# EAGLE design IN-12 (EAGLE 9.6.2)
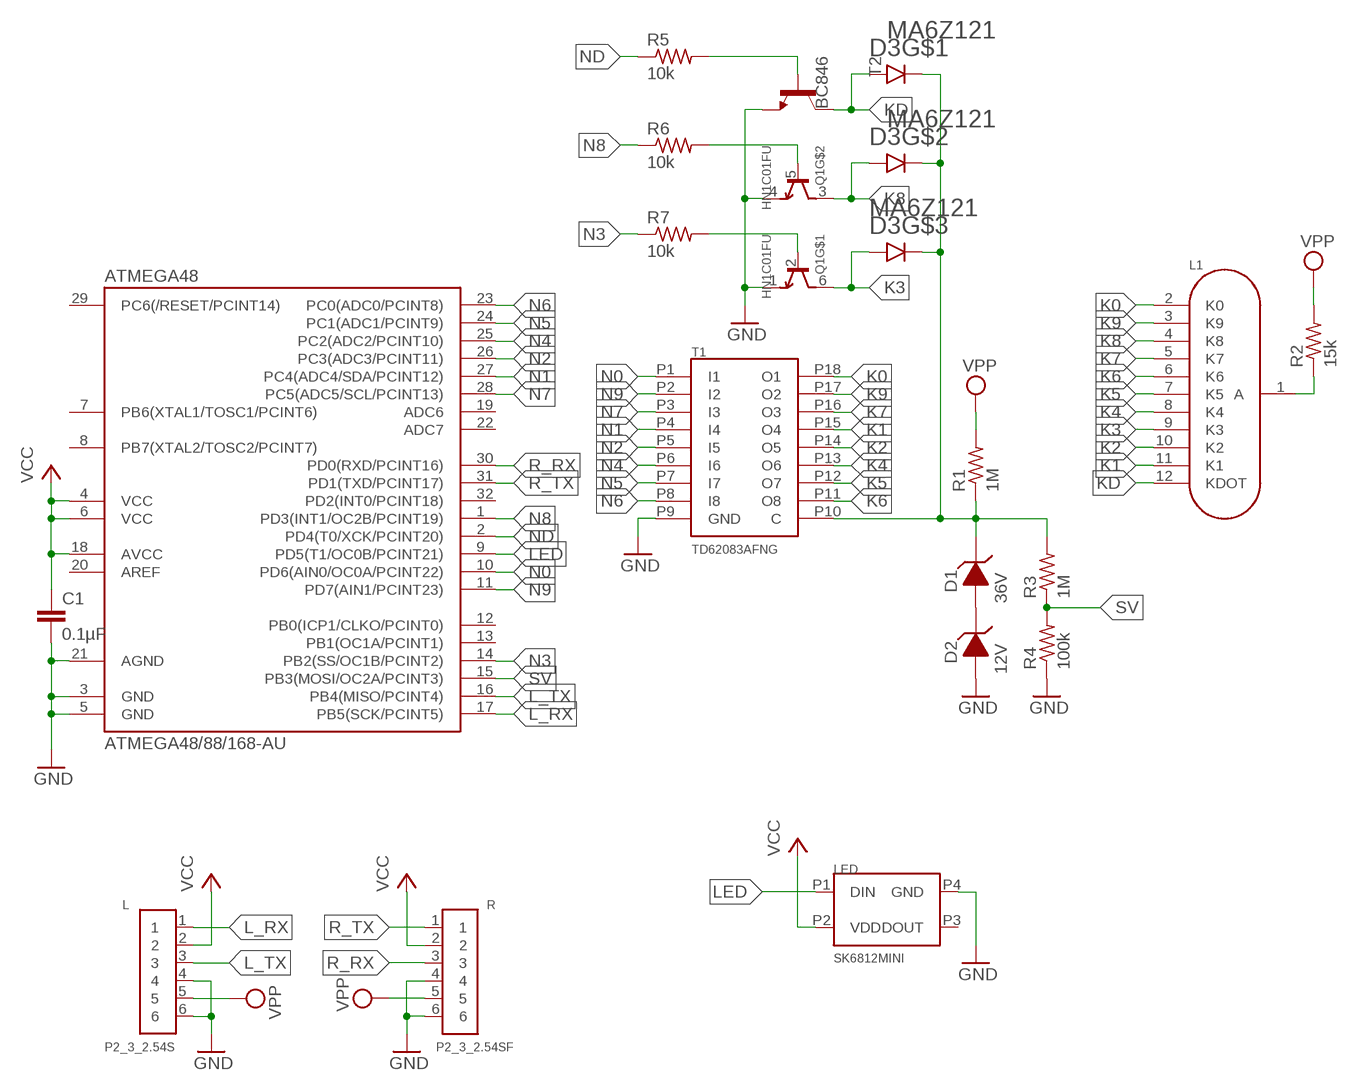
[diagram p0: schematic, sheet 1]

## Parts
ATMEGA48  ATMEGA48/88/168-AU  [TQFP32-08]
C1  0.1µF  C-EUC0603  [C0603]
D1  36V  D_ZENERG  [S-MINI-2P]
D2  12V  D_ZENERG  [S-MINI-2P]
D3  MA6Z121  [SMINI6-F1]
L  P2_3_2.54S  [P2_3_2.54S]
L1  IN-12B_PS  [IN-12_PS]
LED  SK6812MINI  [SK68XXMINI]
Q1  HN1C01FU  [SOT-363]
R  P2_3_2.54SF  [P2_3_2.54SF]
R1  1M  R-US_R0603  [R0603]
R2  15k  R-US_R1206  [R1206]
R3  1M  R-US_R0603  [R0603]
R4  100k  R-US_R0603  [R0603]
R5  10k  R-US_R0603  [R0603]
R6  10k  R-US_R0603  [R0603]
R7  10k  R-US_R0603  [R0603]
T1  TD62083AFNG  [SSOP18-P-225-0.65]
T2  BC846  [SOT23]

## Nets
GND: ATMEGA48.3(GND) ATMEGA48.5(GND) ATMEGA48.21(AGND) C1.2 D2.1(A) L.4 L.6 LED.P4(GND) Q1.1(E) Q1.4(E) R4.1 R.4 R.6 T1.P9(GND) T2.2(E)
K0: L1.2(K0) T1.P18(O1)
K1: L1.11(K1) T1.P15(O4)
K2: L1.10(K2) T1.P14(O5)
K3: D3.P3(A) L1.9(K3) Q1.6(C)
K4: L1.8(K4) T1.P13(O6)
K5: L1.7(K5) T1.P12(O7)
K6: L1.6(K6) T1.P11(O8)
K7: L1.5(K7) T1.P16(O3)
K8: D3.P2(A) L1.4(K8) Q1.3(C)
K9: L1.3(K9) T1.P17(O2)
KD: D3.P1(A) L1.12(KDOT) T2.3(C)
L_RX: ATMEGA48.17(PB5(SCK/PCINT5)) L.1
L_TX: ATMEGA48.16(PB4(MISO/PCINT4)) L.3
LED: ATMEGA48.9(PD5(T1/OC0B/PCINT21)) LED.P1(DIN)
N0: ATMEGA48.10(PD6(AIN0/OC0A/PCINT22)) T1.P1(I1)
N1: ATMEGA48.27(PC4(ADC4/SDA/PCINT12)) T1.P4(I4)
N2: ATMEGA48.26(PC3(ADC3/PCINT11)) T1.P5(I5)
N3: ATMEGA48.14(PB2(SS/OC1B/PCINT2)) R7.1
N4: ATMEGA48.25(PC2(ADC2/PCINT10)) T1.P6(I6)
N5: ATMEGA48.24(PC1(ADC1/PCINT9)) T1.P7(I7)
N6: ATMEGA48.23(PC0(ADC0/PCINT8)) T1.P8(I8)
N7: ATMEGA48.28(PC5(ADC5/SCL/PCINT13)) T1.P3(I3)
N8: ATMEGA48.1(PD3(INT1/OC2B/PCINT19)) R6.1
N9: ATMEGA48.11(PD7(AIN1/PCINT23)) T1.P2(I2)
N$1: D1.1(A) D2.2(C)
N$2: D1.2(C) D3.P4(C) D3.P5(C) D3.P6(C) R1.1 R3.2 T1.P10(C)
N$11: L1.1(A) R2.1
N$12: Q1.2(B) R7.2
N$14: Q1.5(B) R6.2
N$15: R5.2 T2.1(B)
ND: ATMEGA48.2(PD4(T0/XCK/PCINT20)) R5.1
R_RX: ATMEGA48.30(PD0(RXD/PCINT16)) R.3
R_TX: ATMEGA48.31(PD1(TXD/PCINT17)) R.1
SV: ATMEGA48.15(PB3(MOSI/OC2A/PCINT3)) R3.1 R4.2
VCC: ATMEGA48.4(VCC) ATMEGA48.6(VCC) ATMEGA48.18(AVCC) C1.1 L.2 LED.P2(VDD) R.2
VPP: L.5 R1.2 R2.2 R.5
Unconnected: ATMEGA48.7(PB6(XTAL1/TOSC1/PCINT6)) ATMEGA48.8(PB7(XTAL2/TOSC2/PCINT7)) ATMEGA48.12(PB0(ICP1/CLKO/PCINT0)) ATMEGA48.13(PB1(OC1A/PCINT1)) ATMEGA48.19(ADC6) ATMEGA48.20(AREF) ATMEGA48.22(ADC7) ATMEGA48.29(PC6(/RESET/PCINT14)) ATMEGA48.32(PD2(INT0/PCINT18)) LED.P3(DOUT)

## Library data of the parts
ATMEGA48 = atmega8:ATMEGA48/88/168
C1 = rcl:C-EU: CAPACITOR, European symbol; SPICEPREFIX: C
D1 D2 = m-pad-2.1:D_ZENER: Zener diodes in various packages
D3 = diodes:MA6Z121
L = pins:P2_3_2.54S
L1 = nixie-tube:IN-12B_PS
LED = leds:SK6812MINI
Q1 = transistors:HN1C01FU
R = pins:P2_3_2.54SF
R1-R7 = rcl:R-US_: RESISTOR, American symbol; SPICEPREFIX: R
T1 = transistors:TD62083AFNG
T2 = transistor:BC846: NPN TRANSISTOR

## Board
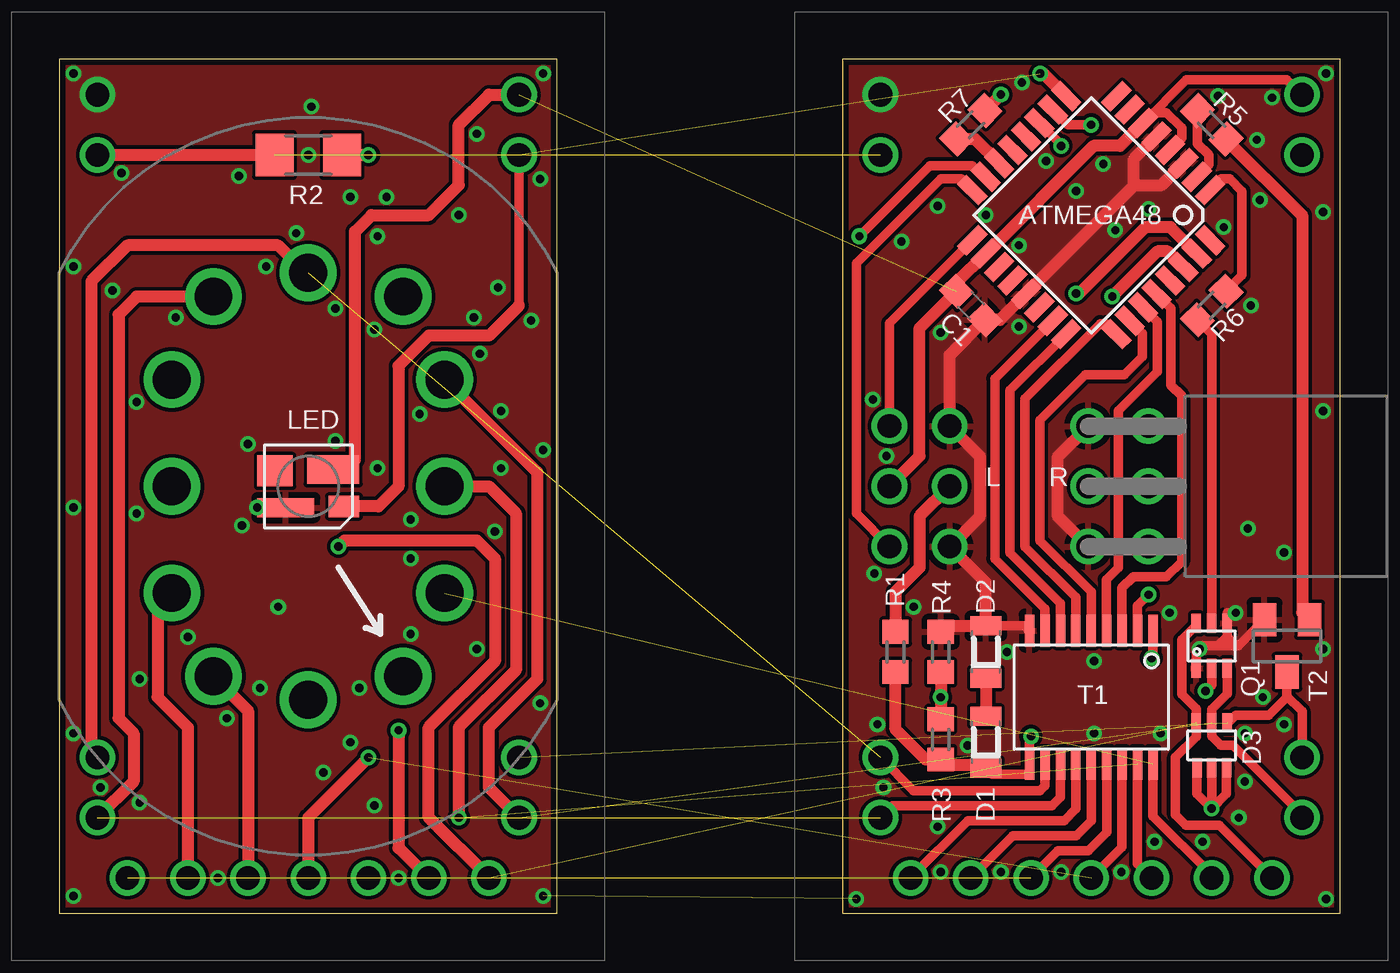
[diagram p1: board, top side]
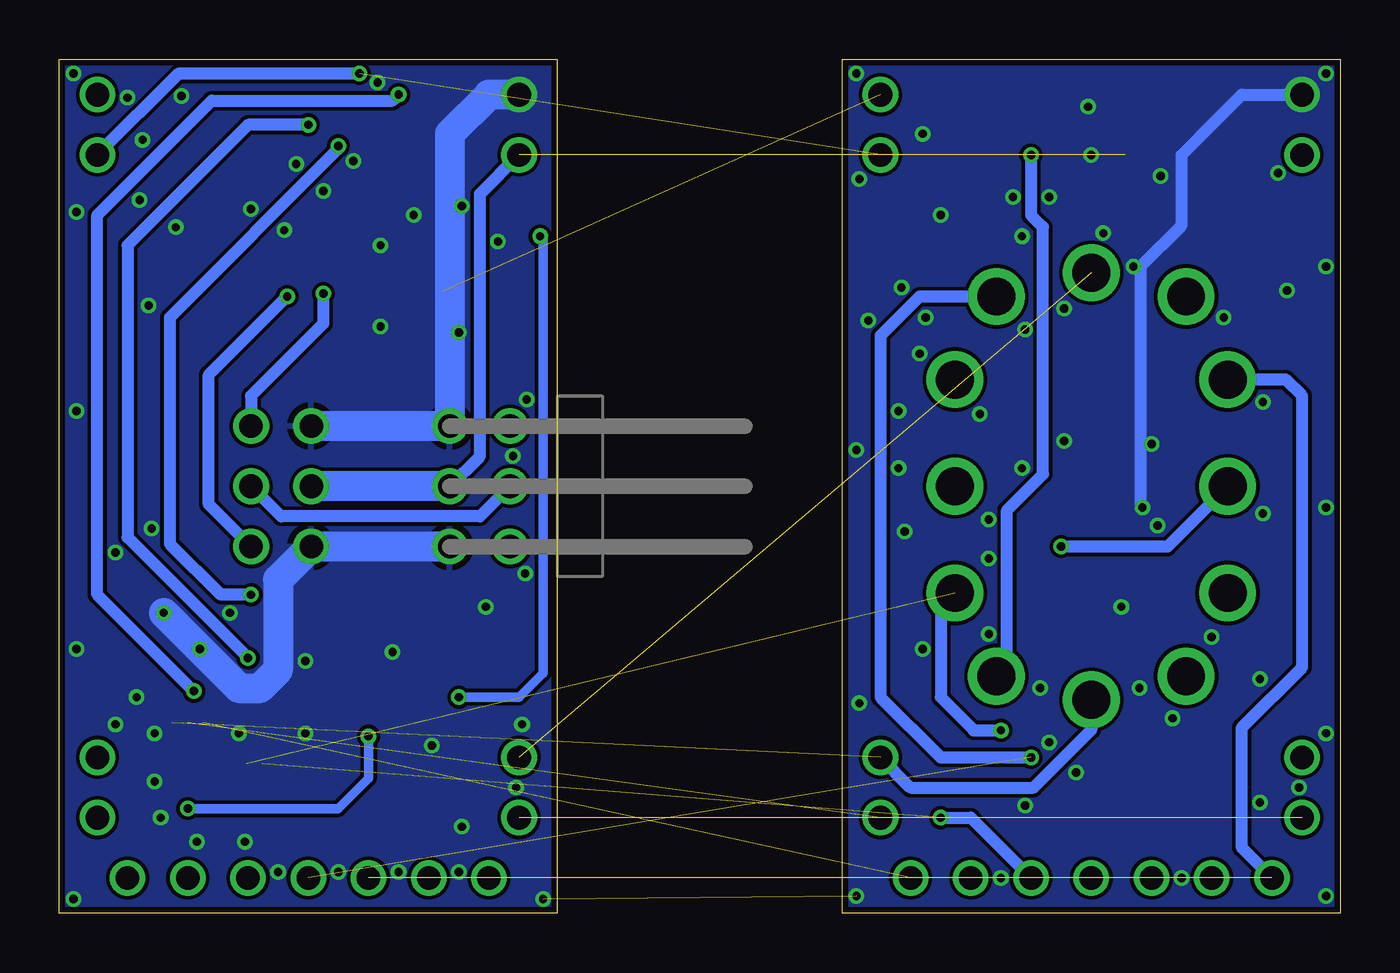
[diagram p2: board, bottom side, seen from below]

Size 54.02 x 36 mm. Coordinates in mm from the lower left corner, seen from the top.
Outline: 0,0 21,0 21,36 0,36 0,0
Outline: 33.02,0 54.02,0 54.02,36 33.02,36 33.02,0
Copper layers (1*16): Top 0.035mm / dielectric 1.5mm / Bottom 0.035mm
Design rules "SeeedStudio_2layer_DRU_no_angle_20140221": minimum track width 6mil, minimum drill 12mil, track to track 6mil, track to pad 6mil, pad to pad 6mil, via to via 6mil, smd to smd 0mil, copper to edge 10mil, drill to drill 10mil, minimum pad ring 10mil, minimum via ring 6mil, stop-mask expansion 2mil, vias tented up to drill 100mil, thermal gap 10mil

### Footprints (pad centres in the part's own frame; a part is rotated, then mirrored left to right if it is on the bottom)
TQFP32-08 = smd 1.27 x 0.559: 1 -4.293,2.8; 2 -4.293,2; 3 -4.293,1.2; 4 -4.293,0.4; 5 -4.293,-0.4; 6 -4.293,-1.2; 7 -4.293,-2; 8 -4.293,-2.8; 17 4.293,-2.8; 18 4.293,-2; 19 4.293,-1.2; 20 4.293,-0.4; 21 4.293,0.4; 22 4.293,1.2; 23 4.293,2; 24 4.293,2.8 | smd 0.559 x 1.27: 9 -2.8,-4.293; 10 -2,-4.293; 11 -1.2,-4.293; 12 -0.4,-4.293; 13 0.4,-4.293; 14 1.2,-4.293; 15 2,-4.293; 16 2.8,-4.293; 25 2.8,4.293; 26 2,4.293; 27 1.2,4.293; 28 0.4,4.293; 29 -0.4,4.293; 30 -1.2,4.293; 31 -2,4.293; 32 -2.8,4.293
C0603 = smd 1.1 x 1: 1 -0.85,0; 2 0.85,0
S-MINI-2P = smd 0.8 x 1.3: 1 -1.1,0; 2 1.1,0
SMINI6-F1 = smd 0.4 x 0.8: P1 -0.65,-0.95; P2 0,-0.95; P3 0.65,-0.95; P4 0.62,0.95; P5 0,0.95; P6 -0.62,0.95
P2_3_2.54S = drill 1: 1 0,2.54; 2 0,0; 3 0,-2.54; 4 -2.54,2.54; 5 -2.54,0; 6 -2.54,-2.54
IN-12_PS = drill 1.6: 1 4,-8; 2 5.75,-4.5; 3 5.75,0; 4 5.75,4.5; 5 4,8; 6 0,9; 7 -4,8; 8 -5.75,4.5; 9 -5.75,0; 10 -5.75,-4.5; 11 -4,-8; 12 0,-9
SK68XXMINI = smd 1.3 x 0.9: P1 1.5,-0.85 | smd 2.2 x 1.2: P2 1.05,0.7 | smd 1.5 x 1.3: P3 -1.4,0.65 | smd 2.4 x 0.8: P4 -0.95,-0.9
SOT-363 = smd 0.4 x 0.8: 1 -0.65,-0.95; 2 0,-0.95; 3 0.65,-0.95; 4 0.65,0.95; 5 0,0.95; 6 -0.65,0.95
P2_3_2.54SF = drill 1: 1 2.54,2.54; 2 2.54,0; 3 2.54,-2.54; 4 0,2.54; 5 0,0; 6 0,-2.54
R0603 = smd 1 x 1.1: 1 -0.85,0; 2 0.85,0
R1206 = smd 1.6 x 1.803: 1 -1.422,0; 2 1.422,0
SSOP18-P-225-0.65 = smd 1.35 x 0.4: P1 -2.8,2.6; P2 -2.8,1.95; P3 -2.8,1.3; P4 -2.8,0.65; P5 -2.8,0; P6 -2.8,-0.65; P7 -2.8,-1.3; P8 -2.8,-1.95; P9 -2.8,-2.6; P10 2.8,-2.6; P11 2.8,-1.95; P12 2.8,-1.3; P13 2.8,-0.65; P14 2.8,0; P15 2.8,0.65; P16 2.8,1.3; P17 2.8,1.95; P18 2.8,2.6
SOT23 = smd 1 x 1.4: 1 -0.95,-1.1; 2 0.95,-1.1; 3 0,1.1

### Placement (x,y rotation side)
ATMEGA48  43.52,29.43 225 top
C1  38.44,25.62 315 top
D1  39.08,7.21 270 top
D2  39.08,11.02 270 top
D3  48.6,7.08 180 top
L  35.01,18 0 bottom
L1  10.5,18 0 top
LED  10.5,18 0 top
Q1  48.6,11.27 0 top
R  43.39,18 0 top
R1  35.27,11.02 90 top
R2  10.5,31.97 180 top
R3  37.17,7.33 270 top
R4  37.17,11.02 270 top
R5  48.6,33.24 315 top
R6  48.6,25.62 225 top
R7  38.44,33.24 45 top
T1  43.52,9.11 270 top
T2  51.77,11.27 180 top

### Tracks (layer width: path | path; a pad name or v marks a point on that pad's centre or on a via)
GND  (via drill 0.35, 1)  (1 unrouted)
  Top 0.406: 47.95,10.38 Q1.1 47.95,11 v48.09,11.14 48.22,11.27 48.85,11.27 | 48.85,11.27 49.25,11.66 | 49.25,11.66 Q1.4 49.25,12.67 v49.62,12.67 | 49.25,11.66 49.65,11.27 | T2.2 49.73,11.27 49.65,11.27 | 48.85,11.27 49.65,11.27 | D2.1 40.72,12.12 T1.P9
  Top 0.508: 45.33,30.67 ATMEGA48.21 39.67,25.02 C1.2 37.55,23.53 L.4 38.82,19.27 38.82,16.73 L.6 39.08,13.94 D2.1 37.42,12.12 R4.1 | 45.33,30.67 45.36,30.7 46.49,30.7 ATMEGA48.3 | 45.33,30.67 45.33,31.8 ATMEGA48.5 | R.6 42.12,16.73 42.12,19.27 R.4 | LED.P4 8.35,17.1 v8.34,17.11
  Bottom 0.508: v8.34,17.11 8.41,17.18 8.41,27.3 6.69,29.01 6.69,31.97 4.15,34.51 v1.61,34.51
  Bottom 1.27: R.4 L.4 37.55,32.86 35.9,34.51 v34.63,34.51 | L.6 R.6 44.79,14.06 44.79,10.25 45.55,9.49 46.44,9.49 v48.09,11.14 v49.62,12.67
  other vias: 39.96,11.02 43.65,10.63 46.44,7.59 43.65,7.59 34.5,7.97 37.04,3.65 37.17,1.74 33.61,0.6 39.71,1.74 42.25,1.74 44.79,1.74 46.19,3.01 48.22,3.01 53.43,0.6 49.74,4.03 50,5.55 50,7.59 51.65,7.97 50.76,9.11 36.03,12.92 34.38,14.32 34.76,5.3 38.31,7.08 34.31,21.66 40.6,35.02 41.61,31.72 39.08,29.43 40.47,28.16 42.88,30.45 44.03,31.59 45.93,29.68 44.54,28.8 49.11,28.92 50.25,25.62 53.3,29.56 50.63,30.06 50.51,32.61 51.14,34.38 53.43,35.4 48.87,34.45 35.52,28.32 34.88,19.27 53.3,11.14 51.65,15.21 50.12,16.22 53.3,21.18 40.47,24.73 37.17,24.48 46.82,12.67 7.96,19.78 7.71,16.35 11.64,19.91 11.64,25.49 20.41,35.4 10.63,34 0.59,35.4 2.63,31.21 7.58,31.08 10.5,31.97 13.8,30.19 12.28,30.19 13.42,28.54 16.85,29.43 17.61,32.86 20.28,30.95 19.9,24.98 18.5,26.38 17.48,25.11 17.74,23.59 13.29,24.6 18.63,21.18 20.41,19.52 18.63,18.76 15.2,21.05 13.42,18.76 9.99,28.67 8.72,27.27 4.91,25.11 2.24,26.26 0.59,27.27 0.59,17.11 3.26,21.56 3.26,16.86 5.42,11.65 9.23,12.92 14.82,16.6 14.82,14.95 18.37,16.09 14.82,11.78 17.61,11.14 12.66,9.49 8.47,9.49 3.39,9.87 7.07,8.22 0.59,7.59 1.74,5.3 3.39,4.66 0.59,0.73 6.69,1.49 14.31,1.49 13.29,4.54 12.28,7.21 11.13,5.94 20.41,0.73 20.28,8.86 37.04,29.81
  pour Top: 45.42,31.97 47.71,29.68 47.71,29.05 47.46,28.8 45.42,28.8 42.88,26.26 42.25,26.26 39.08,29.43 41.61,31.97
  pour Bottom: 32.09,37.05 54.95,37.05 54.95,-1.05 32.09,-1.05
  pour Top: 35.14,4.03 49.36,4.03 49.36,13.43 49.49,13.55 54.31,13.55 54.31,-0.41 32.85,-0.41 32.73,-0.29 32.73,16.22 33.74,16.22 35.27,14.7 36.15,14.7 36.79,15.33 36.79,15.46 39.2,15.46 41.23,13.43 41.23,11.02 45.55,11.02 46.82,9.74 46.82,7.21 40.73,7.21 40.6,7.08 40.34,7.08 39.84,6.57 36.66,6.57 35.27,7.97 35.27,10.51 35.14,10.51
  pour Top: 30.82,37.05 54.95,37.05 54.95,2.76 32.09,2.76 30.82,4.03
  pour Top: -0.93,37.05 21.93,37.05 21.93,-1.05 -0.93,-1.05
  pour Bottom: -2.2,38.32 23.2,38.32 23.2,-2.32 -2.2,-2.32
K0  (via drill 0.35, 1)  (1 unrouted)
  Top 0.406: T1.P18 46.12,4.1 48.6,1.62 v48.6,1.49
  Top 0.508: v14.31,7.71 14.31,2.76 v15.58,1.49
  Bottom 0.508: L1.2 16.85,12.9 16.85,9.11 15.45,7.71 v14.31,7.71
K1  (via drill 1)  (1 unrouted)
  Top 0.406: T1.P15 44.17,3.41 43.39,2.63 42.12,2.63 v40.98,1.49
  Top 0.508: L1.11 7.96,8.54 v7.96,1.49
K2  (via drill 1)  (1 unrouted)
  Top 0.406: T1.P14 43.52,3.9 42.88,3.27 40.22,3.27 v38.44,1.49
  Top 0.508: L1.10 4.17,12.92 4.15,12.92 4.15,9.11 5.42,7.84 v5.42,1.49
K3  (via drill 0.35, 1)  (1 unrouted)
  Top 0.406: Q1.6 47.95,12.14 47.33,11.52 47.33,9.24 47.95,8.62 D3.P3 47.95,7.44 47.08,6.57 47.08,4.16 47.51,3.72 48.91,3.72 v51.14,1.49
  Top 0.508: v11.77,15.46 12.02,15.71 17.61,15.71 18.37,14.95 18.37,10.63 15.58,7.84 15.58,4.03 v18.12,1.49
  Bottom 0.508: L1.9 7.29,15.46 v11.77,15.46
K4  (via drill 1)  (1 unrouted)
  Top 0.406: T1.P13 42.87,4.4 42.38,3.9 38.31,3.9 v35.9,1.49
  Bottom 0.508: v2.88,1.49 4.15,2.76 4.15,7.84 1.61,10.38 1.61,21.81 2.3,22.5 L1.8
K5  (via drill 1)  (1 unrouted)
  Top 0.406: T1.P12 42.22,4.89 41.87,4.54 35.14,4.54 v34.63,4.03
  Top 0.508: L1.7 3.26,26 2.5,25.24 2.5,8.22 3.13,7.59 3.13,5.55 v1.61,4.03
K6  (via drill 1)  (1 unrouted)
  Top 0.406: T1.P11 41.57,5.38 41.36,5.17 36.03,5.17 v34.63,6.57
  Top 0.508: L1.6 10.39,27 9.23,28.16 2.88,28.16 1.36,26.64 1.36,6.82 v1.61,6.57
K7  (via drill 0.35, 1)  (1 unrouted)
  Top 0.406: T1.P16 44.82,2.79 v43.52,1.49
  Top 0.508: v13.04,6.57 10.5,4.03 v10.5,1.49
  Bottom 0.508: L1.5 17.74,26 19.39,24.35 19.39,9.11 16.85,6.57 v13.04,6.57
K8  (via drill 1)  (1 unrouted)
  Top 0.406: Q1.3 49.25,9.25 48.6,8.6 D3.P2 48.6,7.46 48.98,7.08 49.49,7.08 52.41,4.16 v52.41,4.03
  Top 0.508: L1.4 20.15,18.6 20.15,9.87 18.12,7.84 18.12,5.3 v19.39,4.03
K9  (via drill 0.35, 1)  (1 unrouted)
  Top 0.406: T1.P17 45.47,2.08 v46.06,1.49
  Top 0.508: L1.3 18.12,18 19.26,16.86 19.26,10.25 16.85,7.84 v16.85,4.03
  Bottom 0.508: v16.85,4.03 15.58,4.03 v13.04,1.49
KD  (via drill 1)  (1 unrouted)
  Top 0.406: D3.P1 49.3,8.03 49.62,8.35 51.01,8.35 51.77,9.11 T2.3 51.77,9.15 52.41,8.52 v52.41,6.57
  Bottom 0.508: L1.12 10.5,7.73 12.93,5.3 18.12,5.3 v19.39,6.57
L_RX
  Top 0.406: ATMEGA48.17 35.01,24.88 L.1
L_TX
  Top 0.406: ATMEGA48.16 38.04,30.95 37.17,30.95 33.61,27.4 33.61,16.86 L.3
LED  (via drill 0.35, 1)  (1 unrouted)
  Top 0.406: v19.39,31.97 19.39,25.62
  Top 0.508: ATMEGA48.9 41.51,35.4 v41.36,35.4 | 19.39,25.62 18.12,24.35 15.58,24.35 14.31,23.08 14.31,18 13.46,17.15 LED.P1
  Bottom 0.508: v41.36,35.4 48.98,35.4 v52.41,31.97
N0  (via drill 0.35)
  Top 0.406: T1.P1 46.12,10.82 v46.06,10.76 | v43.52,33.24 42.54,33.24 ATMEGA48.10
  Bottom 0.508: v46.06,10.76 51.14,15.84 51.14,28.16 46.06,33.24 v43.52,33.24
N1
  Top 0.406: ATMEGA48.27 46.31,24.94 46.31,22.83 44.66,21.18 44.66,14.57 44.16,14.06 44.16,11.93 T1.P4
N2
  Top 0.406: ATMEGA48.26 45.68,24.44 45.68,23.46 44.92,22.7 43.27,22.7 41.36,20.79 41.36,15.71 43.52,13.55 T1.P5
N3
  Top 0.508: ATMEGA48.14 38.61,32.64 R7.1
N4
  Top 0.406: ATMEGA48.25 44.58,24.44 44.16,24.86 43.9,24.86 40.73,21.68 40.73,15.46 42.87,13.32 T1.P6
N5
  Top 0.406: ATMEGA48.24 40.09,22.04 40.09,15.21 42.22,13.08 T1.P7
N6
  Top 0.406: ATMEGA48.23 39.46,22.54 39.46,14.95 41.57,12.84 T1.P8
N7
  Top 0.406: T1.P3 44.82,13.71 45.3,14.19 46.7,14.19 47.33,14.82 47.33,21.81 46.87,22.27 46.87,25.51 ATMEGA48.28
N8
  Top 0.406: R6.1 49.87,26.89 49.87,30.45 49.36,30.95 49,30.95 ATMEGA48.1
N9  (via drill 0.35)
  Top 0.406: T1.P2 45.47,12.96 v45.93,13.43 | ATMEGA48.11 42.25,32.4 v42.25,32.35
  Bottom 0.508: v45.93,13.43 47.2,13.43 49.36,15.59 49.36,25.11 42.25,32.22 v42.25,32.35
N$1
  Top 0.508: D2.2 D1.1
N$2  (via drill 0.35)
  Top 0.406: D1.2 39.33,5.85 40.92,5.85 T1.P10 40.92,7.4 v40.98,7.46 | D3.P5 v48.6,4.41 | v48.6,4.41 49.22,5.03 D3.P6 | v48.6,4.41 47.98,5.03 D3.P4
  Top 0.508: D1.2 38.95,6.23 37.42,6.23 R3.2 36.54,6.48 35.27,7.75 R1.1
  Bottom 0.406: v40.98,7.46 40.98,5.68 42.25,4.41 v48.6,4.41
N$11  (via drill 0.35)
  Top 0.508: R2.1 v13.04,31.97
  Bottom 0.508: L1.1 14.06,10.44 14.06,16.98 12.53,18.51 12.53,28.92 13.04,29.43 v13.04,31.97
N$12  (via drill 0.35)
  Top 0.406: Q1.2 48.6,9.62 v48.35,9.36
  Top 0.508: R7.2 v39.71,34.51
  Bottom 0.508: v48.35,9.36 52.41,13.43 52.41,29.43 47.58,34.26 39.96,34.26 v39.71,34.51
N$14
  Top 0.406: R6.2 48.6,24.42 Q1.5
N$15
  Top 0.508: R5.2 52.41,29.43 | 52.41,29.43 | T2.1 52.41,12.68 52.41,29.43
ND
  Top 0.406: R5.1 48,32.44 48.47,31.97 48.47,31.55 ATMEGA48.2
R_RX  (via drill 0.35)
  Top 0.508: ATMEGA48.30 46.74,27.91 46.31,27.91 v44.41,26
  Bottom 0.508: R.3 47.71,17.24 47.71,22.7 v44.41,26
R_TX  (via drill 0.35)
  Top 0.508: ATMEGA48.31 46.86,28.92 45.81,28.92 43.01,26.13 v42.88,26.13
  Bottom 0.508: v42.88,26.13 42.88,24.86 45.93,21.81 R.1
SV  (via drill 0.35)
  Top 0.406: ATMEGA48.15 38.98,31.05 38.52,31.51 36.71,31.51 v33.74,28.54
  Top 0.508: R4.2 v37.17,9.11 R3.1
  Bottom 0.406: v33.74,28.54 33.61,28.41 33.61,10.13 34.63,9.11 v37.17,9.11
VCC  (via drill 1)  (1 unrouted)
  Top 0.406: ATMEGA48.4 47.33,32.67 47.33,33.11 46.69,33.75 46.14,33.75 ATMEGA48.6 47.54,35.14 51.77,35.14 v52.41,34.51
  Top 0.508: ATMEGA48.6 44.74,32.35 43.61,32.35 ATMEGA48.18 37.84,26.58 C1.1 36.28,24.66 36.28,19.27 L.2 | v19.39,34.51 18.12,34.51 16.85,33.24 16.85,30.7 15.58,29.43 13.16,29.43 12.47,28.73 12.47,19.11 12.06,18.7 LED.P2
  Bottom 0.508: L.2 36.28,16.73 44.66,16.73 R.2
VPP  (via drill 1)  (1 unrouted)
  Top 0.508: L.5 36.28,16.73 36.28,14.57 35.27,13.55 R1.2 | v1.61,31.97 R2.2
  Bottom 0.508: L.5 36.28,19.27 36.28,30.32 v34.63,31.97
  Bottom 1.27: L.5 R.5

### Text on the board
tStop: Designed by @fujiy0, 2020